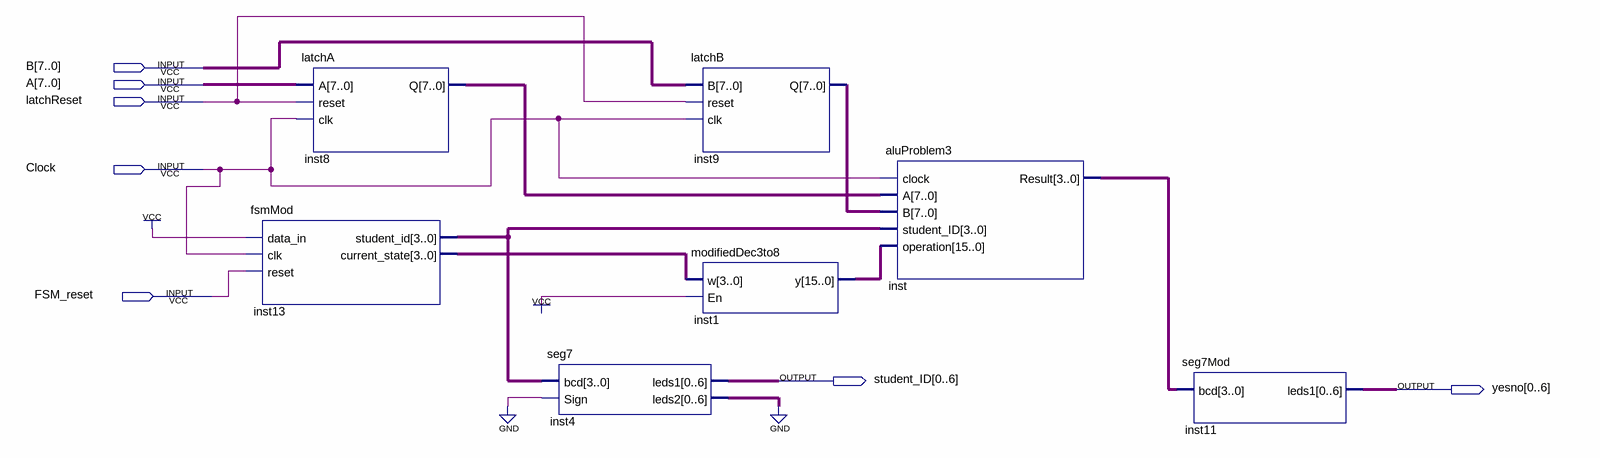
[diagram p0: schematic sheet]
// Quartus schematic problem3.bdf as structural Verilog: 7 symbols, 7 pins
module problem3 (
  input  [7:0] B,
  input  [7:0] A,
  input  latchReset,
  input  Clock,
  input  FSM_reset,
  output [0:6] student_ID,
  output [0:6] yesno
);

  wire [3:0] inst13_current_state, inst13_student_id, inst_result;
  wire [6:0] inst4_leds2;
  wire [7:0] inst8_q, inst9_q;
  wire [15:0] inst1_y;

  fsmMod inst13 (
    .data_in(1'b1), .clk(Clock), .reset(FSM_reset), .student_id(inst13_student_id),
    .current_state(inst13_current_state));
  latchA inst8 (.A(A), .reset(latchReset), .clk(Clock), .Q(inst8_q));
  seg7 inst4 (.bcd(inst13_student_id), .Sign(1'b0), .leds1(student_ID), .leds2(inst4_leds2));
  latchB inst9 (.B(B), .reset(latchReset), .clk(Clock), .Q(inst9_q));
  modifiedDec3to8 inst1 (.w(inst13_current_state), .En(1'b1), .y(inst1_y));
  aluProblem3 inst (
    .clock(Clock), .A(inst8_q), .B(inst9_q), .student_ID(inst13_student_id), .operation(inst1_y),
    .Result(inst_result));
  seg7Mod inst11 (.bcd(inst_result), .leds1(yesno));
  // also tied to GND on the sheet: {inst4_leds2[0], inst4_leds2[1], inst4_leds2[2], inst4_leds2[3], inst4_leds2[4], inst4_leds2[5], inst4_leds2[6]}
endmodule
